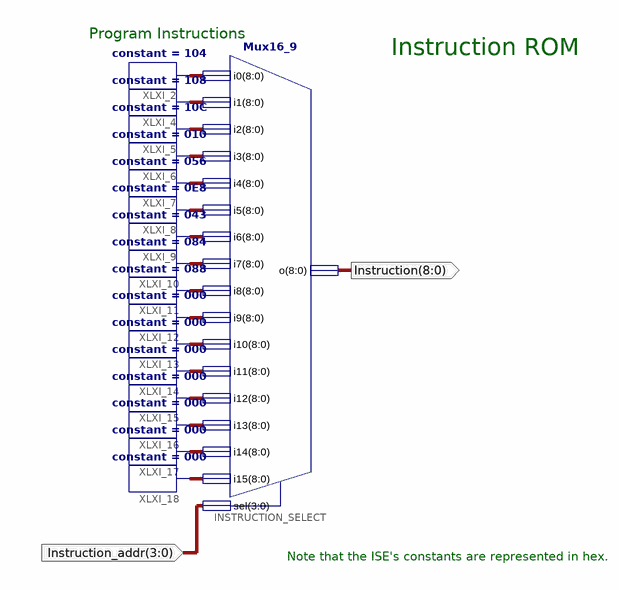
[diagram p0: schematic sheet 1]
// Xilinx ISE schematic Instruction_ROM.sch (spartan6) as structural Verilog: 17 symbols, 2 ports
module Instruction_ROM (
  input  [3:0] Instruction_addr,
  output [8:0] Instruction
);

  wire [8:0] XLXN_2, XLXN_3, XLXN_4, XLXN_5, XLXN_6, XLXN_7, XLXN_8, XLXN_9, XLXN_10, XLXN_11, XLXN_12,
       XLXN_13, XLXN_14, XLXN_15, XLXN_16, XLXN_17;

  Mux16_9 INSTRUCTION_SELECT (
    .i0(XLXN_2), .i1(XLXN_3), .i2(XLXN_4), .i3(XLXN_5), .i4(XLXN_6), .i5(XLXN_7), .i6(XLXN_8), .i7(XLXN_9),
    .i8(XLXN_10), .i9(XLXN_11), .i10(XLXN_12), .i11(XLXN_13), .i12(XLXN_14), .i13(XLXN_15), .i14(XLXN_16),
    .i15(XLXN_17), .sel(Instruction_addr), .o(Instruction));
  constant #(.CValue("104")) XLXI_2 (.O(XLXN_2));
  constant #(.CValue("108")) XLXI_4 (.O(XLXN_3));
  constant #(.CValue("10C")) XLXI_5 (.O(XLXN_4));
  constant #(.CValue("010")) XLXI_6 (.O(XLXN_5));
  constant #(.CValue("056")) XLXI_7 (.O(XLXN_6));
  constant #(.CValue("0E8")) XLXI_8 (.O(XLXN_7));
  constant #(.CValue("043")) XLXI_9 (.O(XLXN_8));
  constant #(.CValue("084")) XLXI_10 (.O(XLXN_9));
  constant #(.CValue("088")) XLXI_11 (.O(XLXN_10));
  constant #(.CValue("000")) XLXI_12 (.O(XLXN_11));
  constant #(.CValue("000")) XLXI_13 (.O(XLXN_12));
  constant #(.CValue("000")) XLXI_14 (.O(XLXN_13));
  constant #(.CValue("000")) XLXI_15 (.O(XLXN_14));
  constant #(.CValue("000")) XLXI_16 (.O(XLXN_15));
  constant #(.CValue("000")) XLXI_17 (.O(XLXN_16));
  constant #(.CValue("000")) XLXI_18 (.O(XLXN_17));

  // Notes on the sheet:
  //   Program Instructions
  //   Instruction ROM
  //   Note that the ISE's constants are represented in hex.
endmodule
